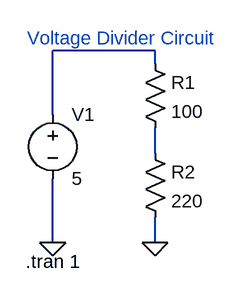
[diagram p0: schematic Draft1.asc]
Draft1.asc, the LTspice schematic file:
Version 4
SHEET 1 880 680
WIRE -16 64 -144 64
WIRE -16 80 -16 64
WIRE -144 144 -144 64
WIRE -16 192 -16 160
WIRE -144 304 -144 224
WIRE -16 304 -16 272
FLAG -144 304 0
FLAG -16 304 0
SYMBOL res -32 64 R0
SYMATTR InstName R1
SYMATTR Value 100
SYMBOL res -32 176 R0
SYMATTR InstName R2
SYMATTR Value 220
SYMBOL voltage -144 128 R0
WINDOW 123 0 0 Left 0
WINDOW 39 0 0 Left 0
SYMATTR InstName V1
SYMATTR Value 5
TEXT -176 48 Left 2 ;Voltage Divider Circuit
TEXT -178 328 Left 2 !.tran 1

The netlist it stands for:
* Draft1.asc
R1 N001 N002 100
R2 N002 0 220
V1 N001 0 5
* Voltage Divider Circuit
.tran 1
.backanno
.end